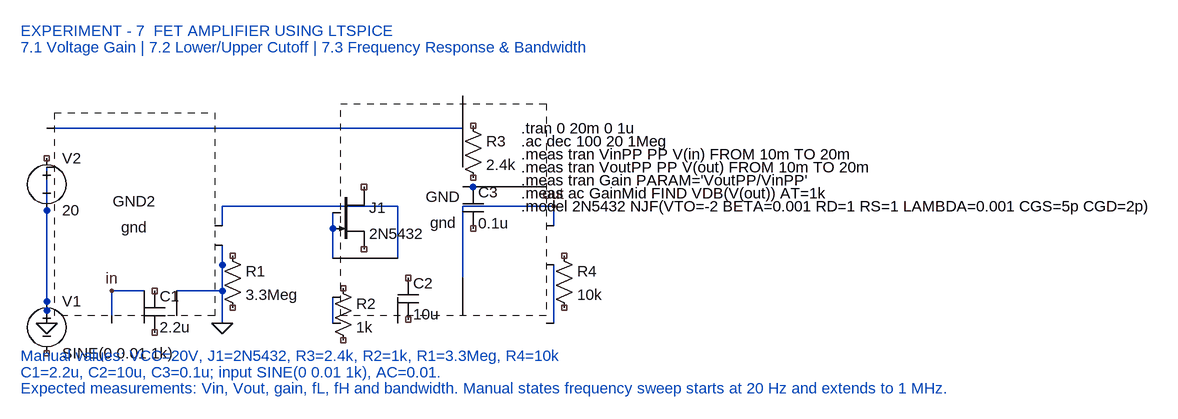
[diagram p0: schematic ECA0407_LTSpice_FET_Amplifier.asc]
ECA0407_LTSpice_FET_Amplifier.asc, the LTspice schematic file:
Version 4
SHEET 1 1200 800
FLAG 220 520 in
FLAG 900 390 out
FLAG 120 570 0
FLAG 390 570 0
SYMBOL voltage 120 300 R0
SYMATTR InstName V2
SYMATTR Value 20
SYMBOL voltage 120 520 R0
SYMATTR InstName V1
SYMATTR Value SINE(0 0.01 1k)
SYMATTR SpiceLine AC 0.01
SYMBOL njf 560 360 R0
SYMATTR InstName J1
SYMATTR Value 2N5432
SYMBOL res 760 250 R0
SYMATTR InstName R3
SYMATTR Value 2.4k
SYMBOL res 560 500 R0
SYMATTR InstName R2
SYMATTR Value 1k
SYMBOL res 390 450 R0
SYMATTR InstName R1
SYMATTR Value 3.3Meg
SYMBOL res 900 450 R0
SYMATTR InstName R4
SYMATTR Value 10k
SYMBOL cap 270 520 R0
SYMATTR InstName C1
SYMATTR Value 2.2u
SYMBOL cap 660 500 R0
SYMATTR InstName C2
SYMATTR Value 10u
SYMBOL cap 760 360 R0
SYMATTR InstName C3
SYMATTR Value 0.1u
SYMBOL gnd 560 570 R0
SYMATTR InstName GND
WIRE 120 270 760 270
WIRE 120 330 120 570
WIRE 120 550 120 570
WIRE 760 270 760 220
WIRE 760 280 760 330
WIRE 760 390 760 500
WIRE 560 400 560 470
WIRE 560 530 560 570
WIRE 390 480 390 570
WIRE 390 420 390 390
WIRE 390 390 560 390
WIRE 270 550 270 570
WIRE 220 520 220 570
WIRE 220 520 270 520
WIRE 320 520 390 520
WIRE 390 520 390 450
WIRE 660 530 660 570
WIRE 660 470 660 390
WIRE 660 390 560 390
WIRE 760 390 900 390
WIRE 900 390 900 420
WIRE 900 480 900 570
WIRE 810 360 760 360
SYMBOL gnd 390 570 R0
SYMATTR InstName GND2
TEXT 80 120 Left 2 EXPERIMENT - 7  FET AMPLIFIER USING LTSPICE
TEXT 80 145 Left 2 7.1 Voltage Gain | 7.2 Lower/Upper Cutoff | 7.3 Frequency Response & Bandwidth
TEXT 80 620 Left 2 Manual values: VCC=20V, J1=2N5432, R3=2.4k, R2=1k, R1=3.3Meg, R4=10k
TEXT 80 645 Left 2 C1=2.2u, C2=10u, C3=0.1u; input SINE(0 0.01 1k), AC=0.01.
TEXT 80 670 Left 2 Expected measurements: Vin, Vout, gain, fL, fH and bandwidth. Manual states frequency sweep starts at 20 Hz and extends to 1 MHz.
TEXT 850 270 Left 2 !.tran 0 20m 0 1u
TEXT 850 290 Left 2 !.ac dec 100 20 1Meg
TEXT 850 310 Left 2 !.meas tran VinPP PP V(in) FROM 10m TO 20m
TEXT 850 330 Left 2 !.meas tran VoutPP PP V(out) FROM 10m TO 20m
TEXT 850 350 Left 2 !.meas tran Gain PARAM='VoutPP/VinPP'
TEXT 850 370 Left 2 !.meas ac GainMid FIND VDB(V(out)) AT=1k
TEXT 850 390 Left 2 !.model 2N5432 NJF(VTO=-2 BETA=0.001 RD=1 RS=1 LAMBDA=0.001 CGS=5p CGD=2p)

The netlist it stands for:
* ECA0407_LTSpice_FET_Amplifier.asc
V2 NC_01 0 20
V1 0 NC_02 SINE(0 0.01 1k) AC 0.01
J1 NC_03 N003 NC_04 2N5432
R3 NC_05 NC_06 2.4k
R2 NC_07 NC_08 1k
R1 NC_09 NC_10 3.3Meg
R4 NC_11 NC_12 10k
C1 NC_13 NC_14 2.2u
C2 NC_15 NC_16 10u
C3 N009 NC_17 0.1u
* GND: gnd (symbol gnd not available, pin order unknown); nets seen at it: N001, N002, N003, N004, N005, N007, N008, N009, out
* GND2: gnd (symbol gnd not available, pin order unknown); nets seen at it: 0, in, N001, N005, N006
.model NJF NJF
.model PJF PJF
.lib standard.jft
* EXPERIMENT - 7  FET AMPLIFIER USING LTSPICE
* 7.1 Voltage Gain | 7.2 Lower/Upper Cutoff | 7.3 Frequency Response & Bandwidth
* Manual values: VCC=20V, J1=2N5432, R3=2.4k, R2=1k, R1=3.3Meg, R4=10k
* C1=2.2u, C2=10u, C3=0.1u; input SINE(0 0.01 1k), AC=0.01.
* Expected measurements: Vin, Vout, gain, fL, fH and bandwidth. Manual states frequency sweep starts at 20 Hz and extends to 1 MHz.
.tran 0 20m 0 1u
.ac dec 100 20 1Meg
.meas tran VinPP PP V(in) FROM 10m TO 20m
.meas tran VoutPP PP V(out) FROM 10m TO 20m
.meas tran Gain PARAM='VoutPP/VinPP'
.meas ac GainMid FIND VDB(V(out)) AT=1k
.model 2N5432 NJF(VTO=-2 BETA=0.001 RD=1 RS=1 LAMBDA=0.001 CGS=5p CGD=2p)
.backanno
.end